# Altium project UW_IPMC_ZYNQ.PrjPcb (part 2 of 2)

## Sheet ZynqPeripherals.SchDoc: ZYNQ-IPMC
size A3; Author: Vicente, M., Gorski., T., Tikalsky, J.; CompanyName: Univ. Wisconsin-Madison; Organization: Univ. Wisconsin-Madison; Address1: Madison, WI 53706; DocumentNumber: 9; Revision: revB; SheetNumber: 9; SheetTotal: 11; ProjectName: ZYNQ-IPMC
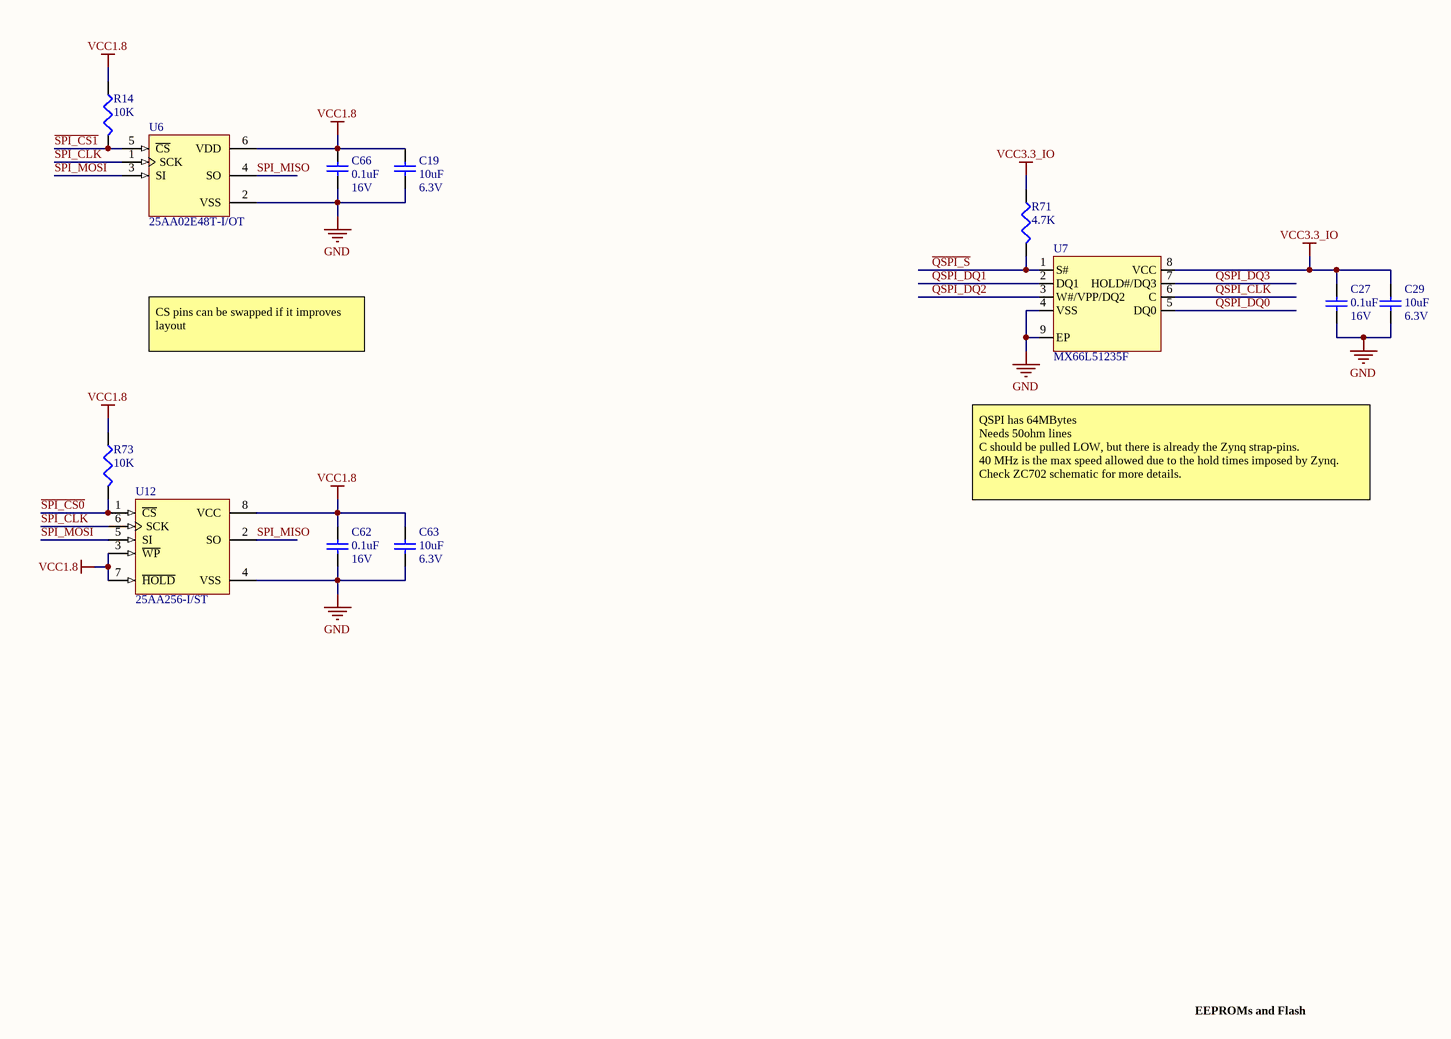
[diagram p7: ZynqPeripherals.SchDoc]

### Parts
C19  value 10uF  Rating: 6.3V  [C0402_IPC_H]  (hidden comment: ?)
C27  value 0.1uF  Rating: 16V  [C0402_IPC_H]  (hidden comment: ?)
C29  value 10uF  Rating: 6.3V  [C0402_IPC_H]  (hidden comment: ?)
C62  value 0.1uF  Rating: 16V  [C0402_IPC_H]  (hidden comment: ?)
C63  value 10uF  Rating: 6.3V  [C0402_IPC_H]  (hidden comment: ?)
C66  value 0.1uF  Rating: 16V  [C0402_IPC_H]  (hidden comment: ?)
R14  value 10K  [R0201_IPC_H]  (hidden comment: ?)
R71  value 4.7K  [R0402_IPC_H]  (hidden comment: ?)
R73  value 10K  [R0201_IPC_H]  (hidden comment: ?)
U6  25AA02E48T-I/OT  [SOT-23-OT6_L]
U7  MX66L51235F  [SON127P800X80_HS-9_N]
U12  25AA256-I/ST  [TSSOP-ST8_L]

### Nets
GND: C19.2 C27.2 C29.2 C62.2 C63.2 C66.2 U6.2(VSS) U7.4(VSS) U7.9(EP) U12.4(VSS)
VCC1.8: C19.1 C62.1 C63.1 C66.1 R14.1 R73.1 U6.6(VDD) U12.3(~{WP}) U12.7(~{HOLD}) U12.8(VCC)
VCC3.3_IO: C27.1 C29.1 R71.1 U7.8(VCC)
~{QSPI_S}: R71.2 U7.1(S#)
~{SPI_CS0}: R73.2 U12.1(~{CS})
~{SPI_CS1}: R14.2 U6.5(~{CS})
QSPI_CLK: U7.6(C)
QSPI_DQ0: U7.5(DQ0)
QSPI_DQ1: U7.2(DQ1)
QSPI_DQ2: U7.3(W#/VPP/DQ2)
QSPI_DQ3: U7.7(HOLD#/DQ3)
SPI_CLK: U6.1(SCK) U12.6(SCK)
SPI_MISO: U6.4(SO) U12.2(SO)
SPI_MOSI: U6.3(SI) U12.5(SI)

### Notes on the sheet
- CS pins can be swapped if it improves layout
- QSPI has 64MBytes
  Needs 50ohm lines
  C should be pulled LOW, but there is already the Zynq strap-pins.
  40 MHz is the max speed allowed due to the hold times imposed by Zynq.
  Check ZC702 schematic for more details.
- EEPROMs and Flash
- Description
- Title
- Size:
- Date:
- A3
- Number:
- Time:
- Revision:
- Sheet
- of
- File:
- Author:

### Library data of the parts
C19 C29 C63 = Cap: as C109 on sheet ZynqPower; PackageDescription: Chip Capacitor
C27 C62 C66 = Cap: as C15 on sheet ZynqMIO; PackageDescription: Chip Capacitor
R14 R73 = Res: as R29 on sheet ZynqMIO; PackageDescription: Chip Resistor
R71 = Res: as R62 on sheet ZynqMIO; PackageDescription: Chip Resistor
U6 = CMP-0165-00270-1: 2K SPI Bus Serial EEPROM with EUI-48 Node Identity, 6-Pin SOT-23, Industrial Temperature, Tape and Reel; Manufacturer: Microchip; INVKEY: IC-EEPROM-2K-SSPI-SOT23; DatasheetVersion: revA, Dec-2008; PackageReference: SOT-23-OT6; PackageVersion: revBB, Aug-2009; PackageDescription: 6-Lead Plastic Small Outline Transistor (OT) [SOT-23]; Code_IPC: SOT26A-6; Part: 25AA02E48T-I/OT
U7 = MX66L51235F: 3V, 512M-bit [x1/x2/x4], CMOS MXSMIO (serial multi I/O) Flash Memory; Part: MX66L51235FZ2I-10G; Manufacturer: Macronix; INVKEY: ?
U12 = CMP-0165-00405-1: 256K SPI Bus Serial EEPROM, 8-Pin TSSOP, Industrial Temperature; Manufacturer: Microchip; INVKEY: IC-EEPROM-256K; Code_JEDEC: MO-153; DatasheetVersion: revF, May-2007; PackageDescription: 8-Lead Plastic Thin Shrink Small Outline (ST) - 4.4mm Body [TSSOP]; PackageReference: TSSOP-ST8; PackageVersion: revBB, Aug-2009; Part: 25AA256-I/ST

## Sheet AnalogSense.SchDoc: ZYNQ-IPMC
size A3; Author: Vicente, M., Gorski., T., Tikalsky, J.; CompanyName: Univ. Wisconsin-Madison; Organization: Univ. Wisconsin-Madison; Address1: Madison, WI 53706; DocumentNumber: 11; Revision: revB; SheetNumber: 11; SheetTotal: 11; ProjectName: ZYNQ-IPMC
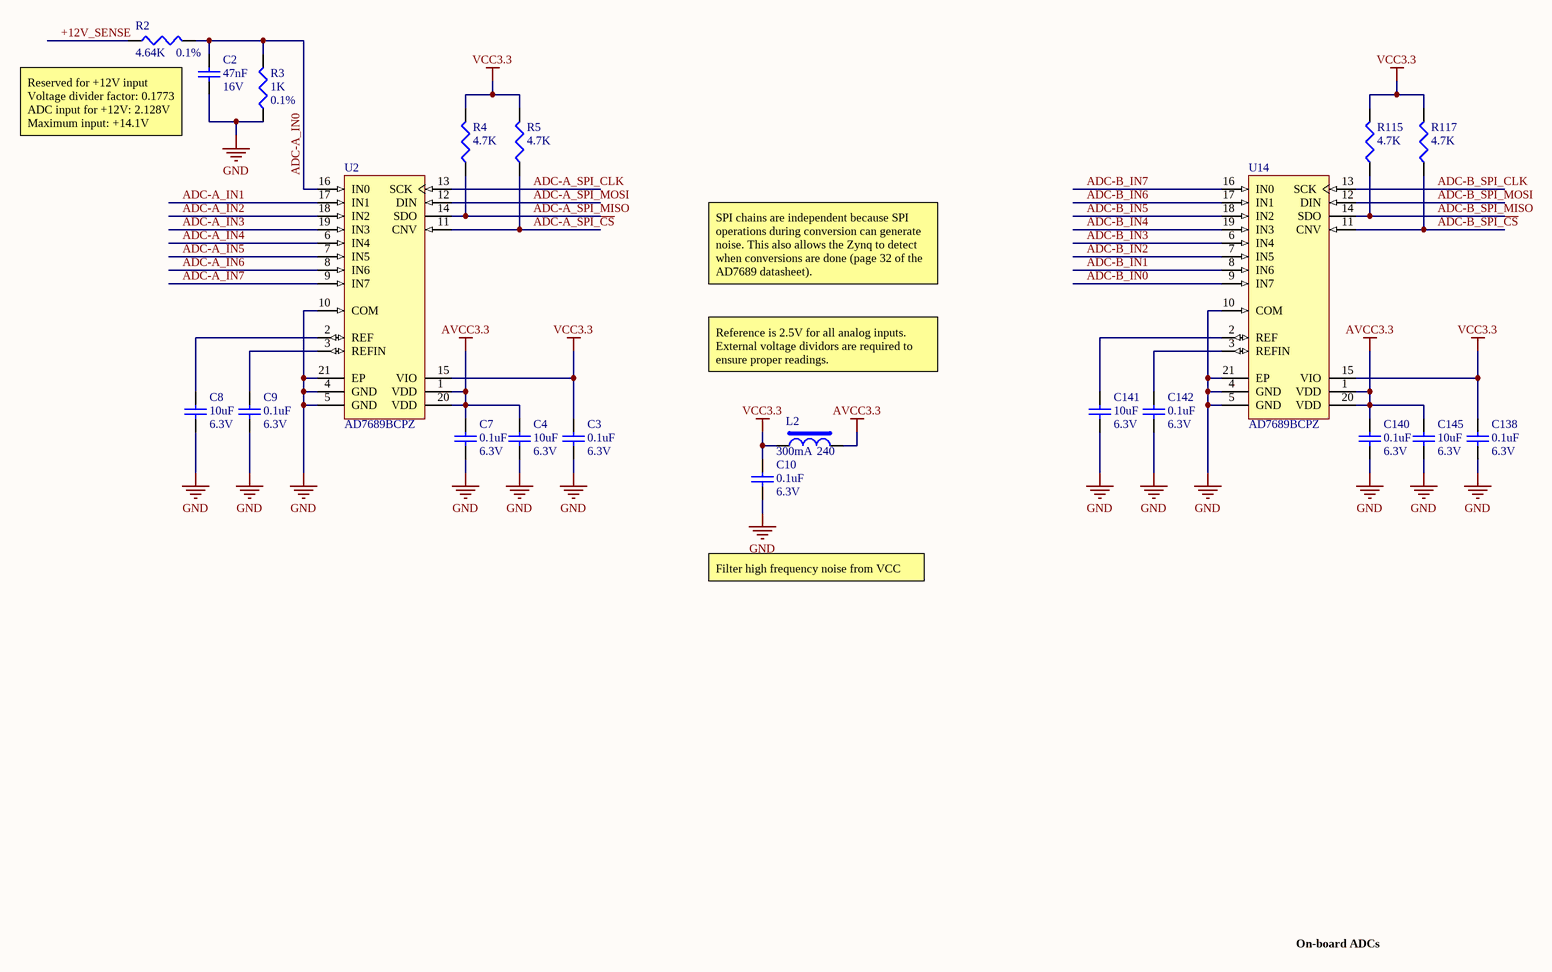
[diagram p8: AnalogSense.SchDoc]

### Parts
C2  value 47nF  Rating: 16V  [C0402_IPC_H]  (hidden comment: ?)
C3  value 0.1uF  Rating: 6.3V  [C0201_IPC_H]  (hidden comment: ?)
C4  value 10uF  Rating: 6.3V  [C0402_IPC_H]  (hidden comment: ?)
C7  value 0.1uF  Rating: 6.3V  [C0201_IPC_H]  (hidden comment: ?)
C8  value 10uF  Rating: 6.3V  [C0402_IPC_H]  (hidden comment: ?)
C9  value 0.1uF  Rating: 6.3V  [C0201_IPC_H]  (hidden comment: ?)
C10  value 0.1uF  Rating: 6.3V  [C0201_IPC_H]  (hidden comment: ?)
C138  value 0.1uF  Rating: 6.3V  [C0201_IPC_H]  (hidden comment: ?)
C140  value 0.1uF  Rating: 6.3V  [C0201_IPC_H]  (hidden comment: ?)
C141  value 10uF  Rating: 6.3V  [C0402_IPC_H]  (hidden comment: ?)
C142  value 0.1uF  Rating: 6.3V  [C0201_IPC_H]  (hidden comment: ?)
C145  value 10uF  Rating: 6.3V  [C0402_IPC_H]  (hidden comment: ?)
L2  value 240  Rated Current: 300mA  [L0402_H]  (hidden comment: BK1005HM241-T)
R2  value 4.64K  Tolerance: 0.1%  [R0603]  (hidden comment: ?)
R3  value 1K  Tolerance: 0.1%  [R0402_IPC_H]  (hidden comment: ?)
R4  value 4.7K  [R0402_IPC_H]  (hidden comment: ?)
R5  value 4.7K  [R0402_IPC_H]  (hidden comment: ?)
R115  value 4.7K  [R0402_IPC_H]  (hidden comment: ?)
R117  value 4.7K  [R0402_IPC_H]  (hidden comment: ?)
U2  AD7689BCPZ  [CP-20-4_N]
U14  AD7689BCPZ  [CP-20-4_N]

### Nets
AVCC3.3: C4.2 C7.2 C140.2 C145.2 L2.2 U2.1(VDD) U2.20(VDD) U14.1(VDD) U14.20(VDD)
GND: C2.1 C3.1 C4.1 C7.1 C8.1 C9.1 C10.1 C138.1 C140.1 C141.1 C142.1 C145.1 R3.1 U2.4(GND) U2.5(GND) U2.10(COM) U2.21(EP) U14.4(GND) U14.5(GND) U14.10(COM) U14.21(EP)
VCC3.3: C3.2 C10.2 C138.2 L2.1 R4.2 R5.2 R115.2 R117.2 U2.15(VIO) U14.15(VIO)
+12V_SENSE: R2.1
~{ADC-A_SPI_CS}: R5.1 U2.11(CNV)
~{ADC-B_SPI_CS}: R117.1 U14.11(CNV)
ADC-A_IN0: C2.2 R2.2 R3.2 U2.16(IN0)
ADC-A_IN1: U2.17(IN1)
ADC-A_IN2: U2.18(IN2)
ADC-A_IN3: U2.19(IN3)
ADC-A_IN4: U2.6(IN4)
ADC-A_IN5: U2.7(IN5)
ADC-A_IN6: U2.8(IN6)
ADC-A_IN7: U2.9(IN7)
ADC-A_SPI_CLK: U2.13(SCK)
ADC-A_SPI_MISO: R4.1 U2.14(SDO)
ADC-A_SPI_MOSI: U2.12(DIN)
ADC-B_IN0: U14.9(IN7)
ADC-B_IN1: U14.8(IN6)
ADC-B_IN2: U14.7(IN5)
ADC-B_IN3: U14.6(IN4)
ADC-B_IN4: U14.19(IN3)
ADC-B_IN5: U14.18(IN2)
ADC-B_IN6: U14.17(IN1)
ADC-B_IN7: U14.16(IN0)
ADC-B_SPI_CLK: U14.13(SCK)
ADC-B_SPI_MISO: R115.1 U14.14(SDO)
ADC-B_SPI_MOSI: U14.12(DIN)
NetC8_2: C8.2 U2.2(REF)
NetC9_2: C9.2 U2.3(REFIN)
NetC141_2: C141.2 U14.2(REF)
NetC142_2: C142.2 U14.3(REFIN)

### Notes on the sheet
- Reserved for +12V input
  Voltage divider factor: 0.1773
  ADC input for +12V: 2.128V
  Maximum input: +14.1V
- SPI chains are independent because SPI operations during conversion can generate noise. This also allows the Zynq to detect when conversions are done (page 32 of the AD7689 datasheet).
- Reference is 2.5V for all analog inputs. External voltage dividors are required to ensure proper readings.
- Filter high frequency noise from VCC
- On-board ADCs
- Description
- Title
- Size:
- Date:
- A3
- Number:
- Time:
- Revision:
- Sheet
- of
- File:
- Author:

### Library data of the parts
C2 = Cap: Capacitor; Part: GRM155R71C473KA01D; Manufacturer: Murata; INVKEY: CP0402-47nf-16V-10%; PackageDescription: Chip Capacitor
C3 C7 C9 C10 C138 C140 C142 = Cap: Capacitor; Manufacturer: Murata; Part: GRM033R60J104KE19D; INVKEY: CP0201-0.1UF-6.3V-10%; PackageDescription: Chip Capacitor
C4 C8 C141 C145 = Cap: Capacitor; Manufacturer: Murata; Part: GRM155R60J106ME44D; INVKEY: CP0402-10UF-6V3-20%; PackageDescription: Chip Capacitor
L2 = Bead: Bead Inductor; Manufacturer: Taiyo Yuden; Measuring Frequency: 100MHz; INVKEY: FB-BK1005HM241-T; PackageDescription: Chip Inductor; Part: BK1005HM241-T
R2 = Res: Resistor; Manufacturer: Susumu Co Ltd; Part: RG1608P-4641-B-T1; INVKEY: RS0603-4K64-1/10W-PREC; PackageDescription: Chip Resistor
R3 = Res: Resistor; Manufacturer: Vishay; Part: TNPW04021K00BEED; INVKEY: RS0402-1K-1/16W-PREC; PackageDescription: Chip Resistor
R4 R5 R115 R117 = Res: Resistor; Manufacturer: Panasonic; Part: ERJ-2RKF4701X; Tolerance: 1%; INVKEY: RS0402-4K7-1/10W-1%; PackageDescription: Chip Resistor
U2 U14 = CMP-0313-00576-2: Octal 16-Bit PulSAR Analog-to-Digital Converter with Serial, SPI Interface, 250KSPS, -40 to +85 degC, CP-20-4, Pb-Free, Tube; Generic Part Number: AD7689; Manufacturer: Analog; Throughput Rate (SPS): 250K; Resolution (Bits): 16; Interface: Ser, SPI; Channels: 8; INVKEY: IC-ADC-AD7689BCPZ; PackageReference: CP-20-4; ComponentLink1Description: Manufacturer URL; Packing: Tube; ComponentLink3Description: Package Specification; RoHS: Y; ComponentLink4Description: Product URL; ComponentLink3URL: http://www.analog.com/static/imported-files/packages/PKG_PDF/LFCSP(CP)/CP_20_4.pdf; ComponentLink1URL: http://www.analog.com/en/index.html; ComponentLink4URL: http://www.analog.com/en/analog-to-digital-converters/ad-converters/ad7689/products/product.html; PackageVersion: 012508-B; ComponentLink2Description: Datasheet; ComponentLink2URL: http://www.analog.com/static/imported-files/data_sheets/AD7682_7689.pdf; PackageDescription: 20-Lead Lead Frame Chip Scale Package [LFCSP_VQ] 4 x 4 mm Body, Very Thin Quad; Mounting Technology: Surface Mount; Code_JEDEC: MO-220-VGGD-1; DatasheetVersion: Rev.D; PartNumber: AD7689BCPZ; Part: AD7689BCPZ

## Sheet PowerSequence.SchDoc: ZYNQ-IPMC
size A3; Author: Vicente, M., Gorski., T., Tikalsky, J.; CompanyName: Univ. Wisconsin-Madison; Organization: Univ. Wisconsin-Madison; Address1: Madison, WI 53706; DocumentNumber: 7; Revision: revB; SheetNumber: 7; SheetTotal: 11; ProjectName: ZYNQ-IPMC
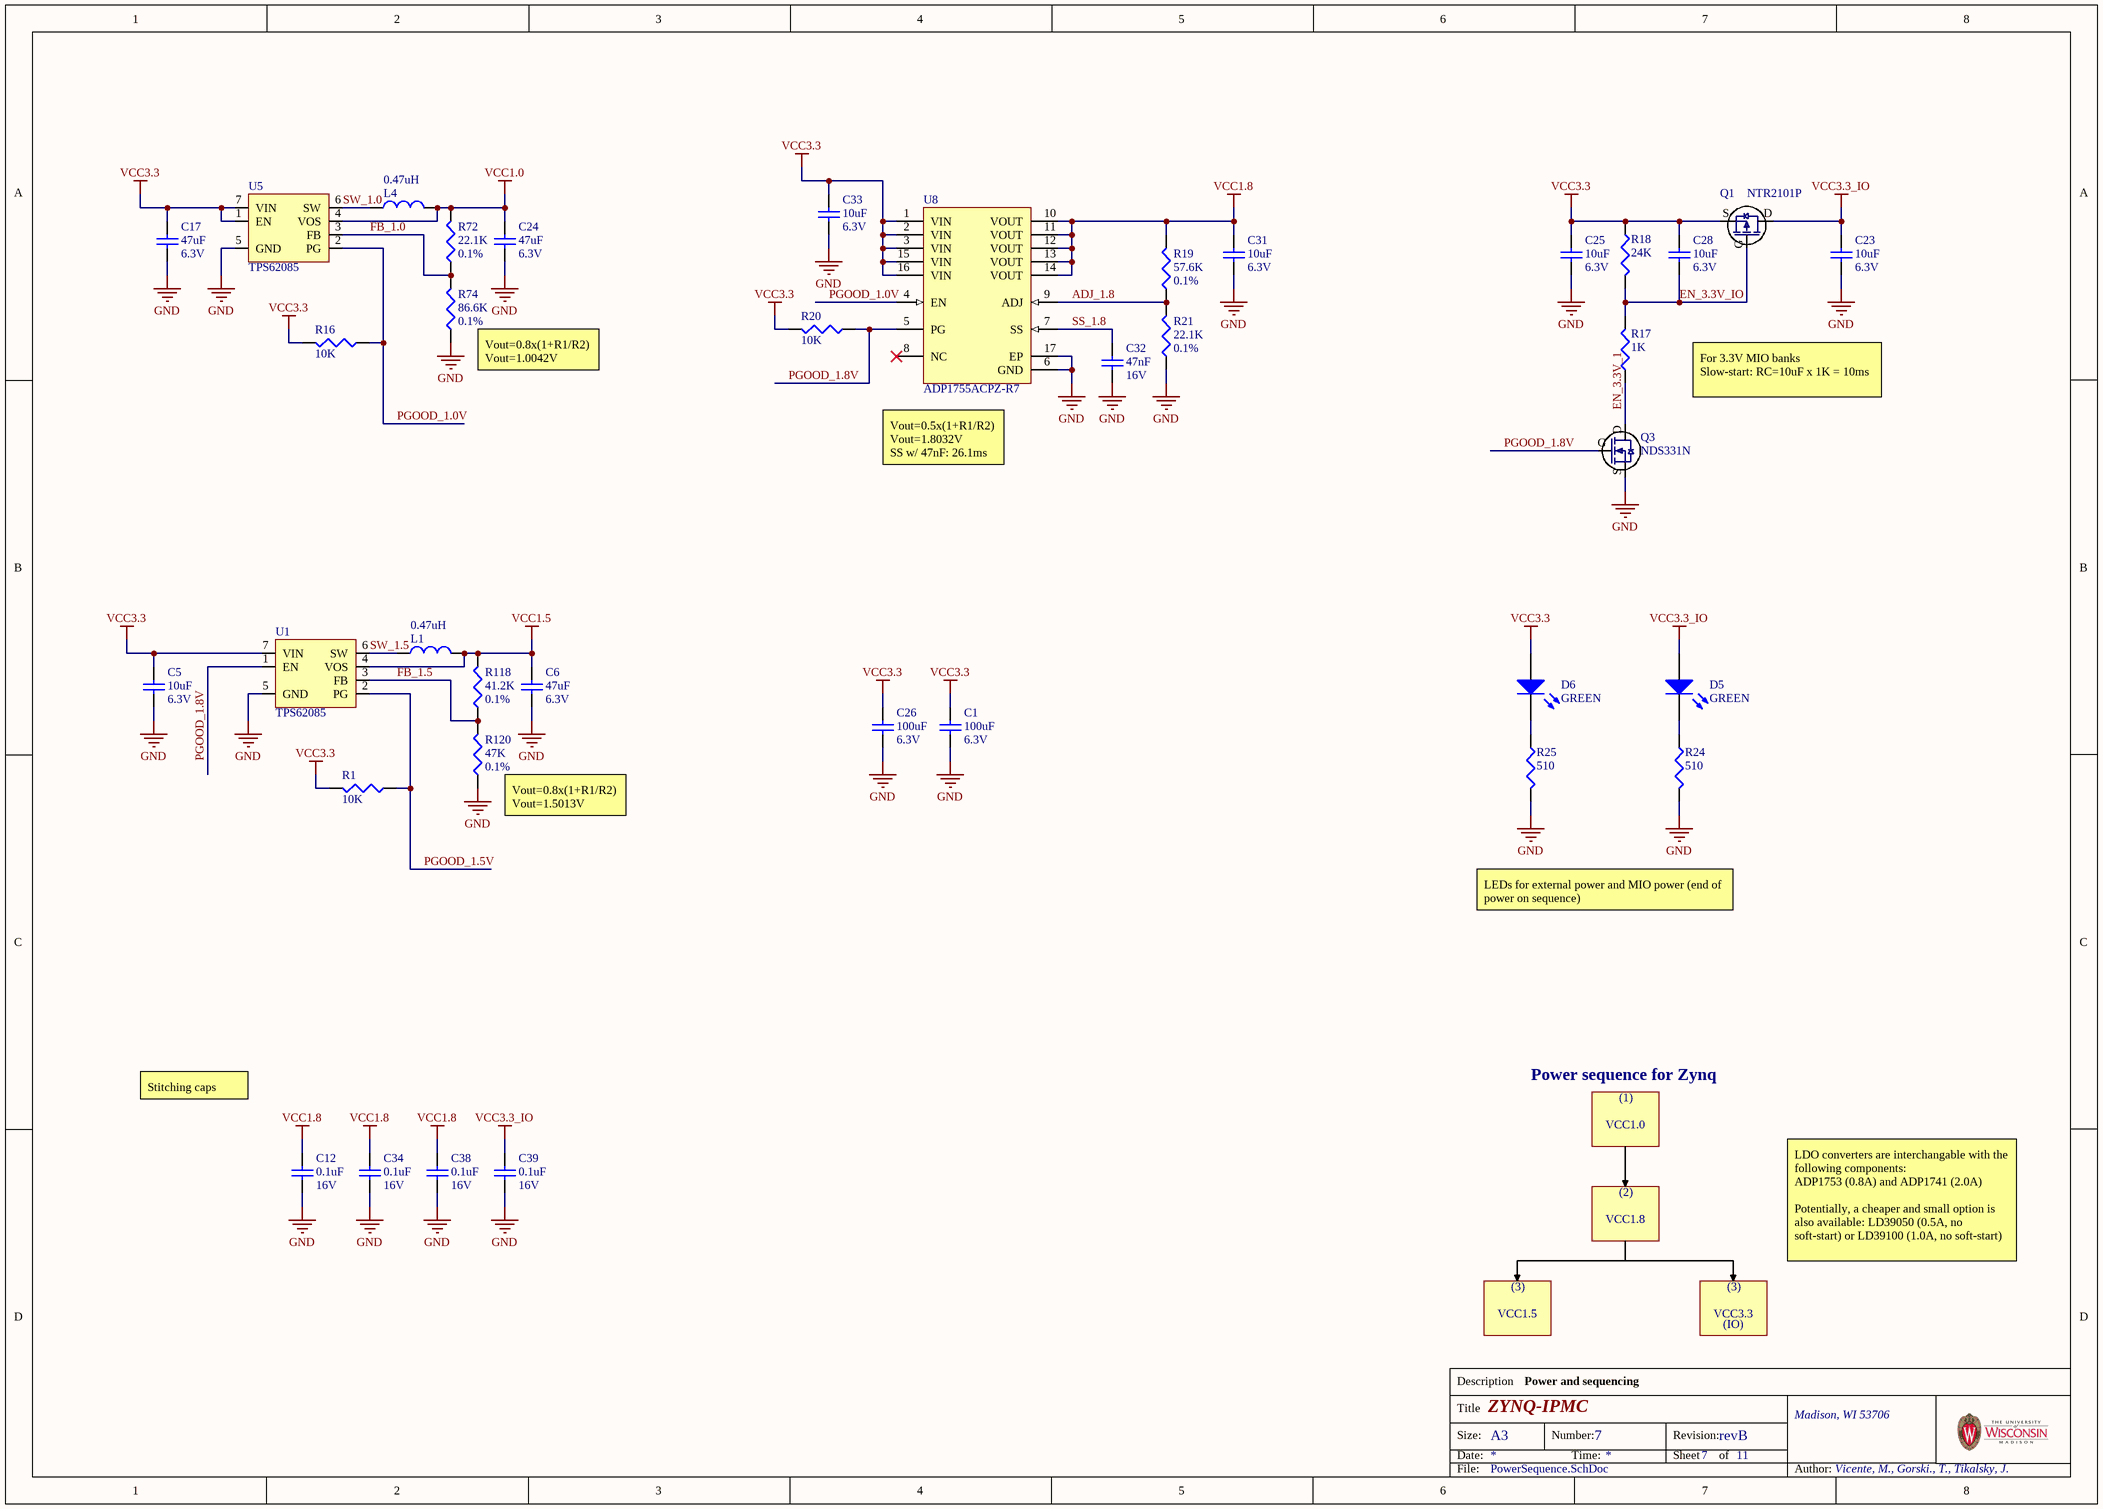
[diagram p9: PowerSequence.SchDoc]

### Parts
C1  value 100uF  Rating: 6.3V  [C1210_IPC_H]  (hidden comment: ?)
C5  value 10uF  Rating: 6.3V  [C0402_IPC_H]  (hidden comment: ?)
C6  value 47uF  Rating: 6.3V  [C0805_M]  (hidden comment: ?)
C12  value 0.1uF  Rating: 16V  [C0402_IPC_H]  (hidden comment: ?)
C17  value 47uF  Rating: 6.3V  [C0805_M]  (hidden comment: ?)
C23  value 10uF  Rating: 6.3V  [C0402_IPC_H]  (hidden comment: ?)
C24  value 47uF  Rating: 6.3V  [C0805_M]  (hidden comment: ?)
C25  value 10uF  Rating: 6.3V  [C0402_IPC_H]  (hidden comment: ?)
C26  value 100uF  Rating: 6.3V  [C1210_IPC_H]  (hidden comment: ?)
C28  value 10uF  Rating: 6.3V  [C0402_IPC_H]  (hidden comment: ?)
C31  value 10uF  Rating: 6.3V  [C0402_IPC_H]  (hidden comment: ?)
C32  value 47nF  Rating: 16V  [C0402_IPC_H]  (hidden comment: ?)
C33  value 10uF  Rating: 6.3V  [C0402_IPC_H]  (hidden comment: ?)
C34  value 0.1uF  Rating: 16V  [C0402_IPC_H]  (hidden comment: ?)
C38  value 0.1uF  Rating: 16V  [C0402_IPC_H]  (hidden comment: ?)
C39  value 0.1uF  Rating: 16V  [C0402_IPC_H]  (hidden comment: ?)
D5  value GREEN  [LED0603_M]  (hidden comment: ?)
D6  value GREEN  [LED0603_M]  (hidden comment: ?)
L1  value 0.47uH  [L2520_H]  (hidden comment: DFE252012F-R47M=P2)
L4  value 0.47uH  [L2520_H]  (hidden comment: DFE252012F-R47M=P2)
Q1  NTR2101P  [SOT23-H]
Q3  NDS331N  [SOT23-H]
R1  value 10K  [R0201_IPC_H]  (hidden comment: ?)
R16  value 10K  [R0201_IPC_H]  (hidden comment: ?)
R17  value 1K  [R0402_IPC_H]  (hidden comment: ?)
R18  value 24K  [R0402_IPC_H]  (hidden comment: ?)
R19  value 57.6K  Tolerance: 0.1%  [R0402_IPC_H]  (hidden comment: ?)
R20  value 10K  [R0201_IPC_H]  (hidden comment: ?)
R21  value 22.1K  Tolerance: 0.1%  [R0402_IPC_H]  (hidden comment: ?)
R24  value 510  [R0402_IPC_H]  (hidden comment: ?)
R25  value 510  [R0402_IPC_H]  (hidden comment: ?)
R72  value 22.1K  Tolerance: 0.1%  [R0402_IPC_H]  (hidden comment: ?)
R74  value 86.6K  Tolerance: 0.1%  [R0402_IPC_H]  (hidden comment: ?)
R118  value 41.2K  Tolerance: 0.1%  [R0402_IPC_H]  (hidden comment: ?)
R120  value 47K  Tolerance: 0.1%  [R0402_IPC_H]  (hidden comment: ?)
U1  TPS62085  [VSON-8_L]
U5  TPS62085  [VSON-8_L]
U8  ADP1755ACPZ-R7  [CP-16-4_L]

### Nets
GND: C1.2 C5.2 C6.1 C12.2 C17.2 C23.2 C24.1 C25.2 C26.2 C31.1 C32.2 C33.2 C34.2 C38.2 C39.2 Q3.S R21.1 R24.2 R25.2 R74.1 R120.1 U1.5(GND) U5.5(GND) U8.6(GND) U8.17(EP)
VCC1.0: C24.2 L4.2 R72.2 U5.4(VOS)
VCC1.5: C6.2 L1.2 R118.2 U1.4(VOS)
VCC1.8: C12.1 C31.2 C34.1 C38.1 R19.2 U8.10(VOUT) U8.11(VOUT) U8.12(VOUT) U8.13(VOUT) U8.14(VOUT)
VCC3.3: C1.1 C5.1 C17.1 C25.1 C26.1 C28.1 C33.1 D6.1(A) Q1.S R1.2 R16.2 R18.1 R20.2 U1.7(VIN) U5.1(EN) U5.7(VIN) U8.1(VIN) U8.2(VIN) U8.3(VIN) U8.15(VIN) U8.16(VIN)
VCC3.3_IO: C23.1 C39.1 D5.1(A) Q1.D
ADJ_1.8: R19.1 R21.2 U8.9(ADJ)
EN_3.3V_1: Q3.D R17.1
EN_3.3V_IO: C28.2 Q1.G R17.2 R18.2
FB_1.0: R72.1 R74.2 U5.3(FB)
FB_1.5: R118.1 R120.2 U1.3(FB)
PGOOD_1.0V: R16.1 U5.2(PG) U8.4(EN)
PGOOD_1.5V: R1.1 U1.2(PG)
PGOOD_1.8V: Q3.G R20.1 U1.1(EN) U8.5(PG)
SS_1.8: C32.1 U8.7(SS)
SW_1.0: L4.1 U5.6(SW)
SW_1.5: L1.1 U1.6(SW)
NetD5_2: D5.2(K) R24.1
NetD6_2: D6.2(K) R25.1

Not connected (* = marked no-connect by the designer): U8 8(NC)*

### Notes on the sheet
- (near R74) Vout=0.8x(1+R1/R2)
  Vout=1.0042V
- For 3.3V MIO banks
  Slow-start: RC=10uF x 1K = 10ms
- (near U8) Vout=0.5x(1+R1/R2)
  Vout=1.8032V
  SS w/ 47nF: 26.1ms
- (near R120) Vout=0.8x(1+R1/R2)
  Vout=1.5013V
- LEDs for external power and MIO power (end of power on sequence)
- Stitching caps
- Power sequence for Zynq
- VCC1.0
- (1)
- VCC1.8
- (2)
- LDO converters are interchangable with the following components:
  ADP1753 (0.8A) and ADP1741 (2.0A)
  Potentially, a cheaper and small option is also available: LD39050 (0.5A, no soft-start) or LD39100 (1.0A, no soft-start)
- VCC1.5
- (3)
- VCC3.3
- (IO)
- Power and sequencing
- Description
- Title
- Size:
- Date:
- A3
- Number:
- Time:
- Revision:
- Sheet
- of
- File:
- Author:

### Library data of the parts
C1 C26 = Cap: Capacitor; Part: GRM32ER60J107ME20L; Manufacturer: Murata; INVKEY: CP1210-100UF-6.3V-20%; PackageDescription: Chip Capacitor
C5 C23 C25 C28 C31 C33 = Cap: as C4 on sheet AnalogSense; PackageDescription: Chip Capacitor
C6 C17 C24 = Cap: Capacitor; Manufacturer: TDK; Part: C2012X5R0J476M125AC; INVKEY: CP0805-47UF-6.3V; PackageDescription: Chip Capacitor
C12 C34 C38 C39 = Cap: Capacitor; Manufacturer: Murata; Part: GRM155R71C104KA88D; INVKEY: CP0402-0.1UF-16V-10%; PackageDescription: Chip Capacitor
C32 = Cap: as C2 on sheet AnalogSense; PackageDescription: Chip Capacitor
D5 D6 = LED: Light Emitting Diode; Manufacturer: Lite-On; Part: LTST-C190KGKT; INVKEY: LED-GN-TOP-0603
L1 L4 = Ind: Inductor; Manufacturer: Murata; Tolerance: 20%; DC Resistance: 23mOhm; DC Current: 6.7A; INVKEY: IND-DFE2520102F; PackageDescription: Chip Inductor; Part: DFE252012F-R47M=P2
Q1 = NTR2101P: Small Signal MOSFET, −8.0V, −3.7 A, Single P−Channel, SOT−23; pin to pad: D>3 G>1 S>2; Manufacturer: On Semiconductor; INVKEY: MOS-NTR2101P-SOT23; Part: NTR2101P
Q3 = NDS331N: N-Channel   Logic Level Enhancement Mode Field Effect Transistor; pin to pad: D>3 G>1 S>2; Manufacturer: Fairchild; INVKEY: FET-NDS331N-SSOT23; Part: NDS331N
R1 R16 R20 = Res: Resistor; Manufacturer: Panasonic; Part: ERJ-1GNF1002C; Tolerance: 1%; INVKEY: RS0201-10K-1/20W-1%; PackageDescription: Chip Resistor
R17 = Res: Resistor; Manufacturer: Panasonic-ECG; Part: ERJ-2RKF1001X; Tolerance: 1%; INVKEY: RS0402-1K-1/10W-1%; PackageDescription: Chip Resistor
R18 = Res: Resistor; Manufacturer: Panasonic; Part: ERJ-2RKF2402X; Tolerance: 1%; INVKEY: RS0402-24K-1/10W-1%; PackageDescription: Chip Resistor
R19 = Res: Resistor; Manufacturer: Panasonic; Part: ERA-2AEB5762X; INVKEY: R0402-57K6-1/16W-PREC; PackageDescription: Chip Resistor
R21 R72 = Res: Resistor; Manufacturer: Panasonic; Part: ERA-2AEB2212X; INVKEY: RS0402-22K1-1/16W-PREC; PackageDescription: Chip Resistor
R24 R25 = Res: Resistor; Manufacturer: Panasonic-ECG; Part: ERJ-2RKF5100X; Tolerance: 1%; INVKEY: RS0402-510R-1/10W-1%; PackageDescription: Chip Resistor
R74 = Res: Resistor; Manufacturer: Panasonic-ECG; Part: ERA-2AEB8662X; INVKEY: RS0402-86K6-1/16W-PREC; PackageDescription: Chip Resistor
R118 = Res: Resistor; Manufacturer: Panasonic; Part: ERA-2AEB4122X; INVKEY: RS0402-41K2-1/16W-PREC; PackageDescription: Chip Resistor
R120 = Res: Resistor; Manufacturer: Panasonic; Part: ERA-2AEB473X; INVKEY: RS0402-47K-1/16W-PREC; PackageDescription: Chip Resistor
U1 U5 = TPS62085: 3-A Step-Down Converter With Hiccup Short-Circuit Protection; Manufacturer: Texas Instruments; INVKEY: IC-TPS62085; Part: TPS62085
U8 = CMP-0786-00436-1: 1.2 A, Low VIN, Low Dropout Linear Regulator, 1.6 to 3.6 V Vin, 0.75 to 3 V Vout, Industrial, 16-pin QFN (CP-16-4), Reel; Manufacturer: Analog; Vin (min) (V): 1.6; Vin (max) (V): 3.6; Vout Adjustable Range: 0.75V to 3.3V; Iout max: 1.2A; Supply Current IGND @ Small Load: 90uA; INVKEY: IC-REG-ADP1755ACPZ; PackageVersion: 010606-0, 01/2006; ComponentLink3URL: http://www.analog.com/static/imported-files/packages/46009454504174339653421710019CP_16_4.pdf; ComponentLink4URL: Product URL:http://www.analog.com/en/ADP1755/productSearch.html; ComponentLink1Description: Manufacturer URL; Packing: Reel; PackageDescription: 16-Pin Lead Frame Chip Scale Package, Body 4 x 4 mm, Pitch 0.65 mm; ComponentLink2URL: http://www.analog.com/static/imported-files/data_sheets/ADP1754_1755.pdf; PackageReference: CP-16-4; DatasheetVersion: Rev. D; ComponentLink4Description: URL Link1; Code_JEDEC: MO-220-VGGC; PartNumber: ADP1755ACPZ-R7; ComponentLink3Description: Package Specification; Mounting Technology: Surface Mount; ComponentLink1URL: http://www.analog.com/en/index.html; ComponentLink2Description: Datasheet; Part: ADP1755ACPZ-R7

## Sheet BoardConnector.SchDoc: ZYNQ-IPMC
size A3; Author: Vicente, M., Gorski., T., Tikalsky, J.; CompanyName: Univ. Wisconsin-Madison; Organization: Univ. Wisconsin-Madison; Address1: Madison, WI 53706; DocumentNumber: 2; Revision: revB; SheetNumber: 2; SheetTotal: 11; ProjectName: ZYNQ-IPMC
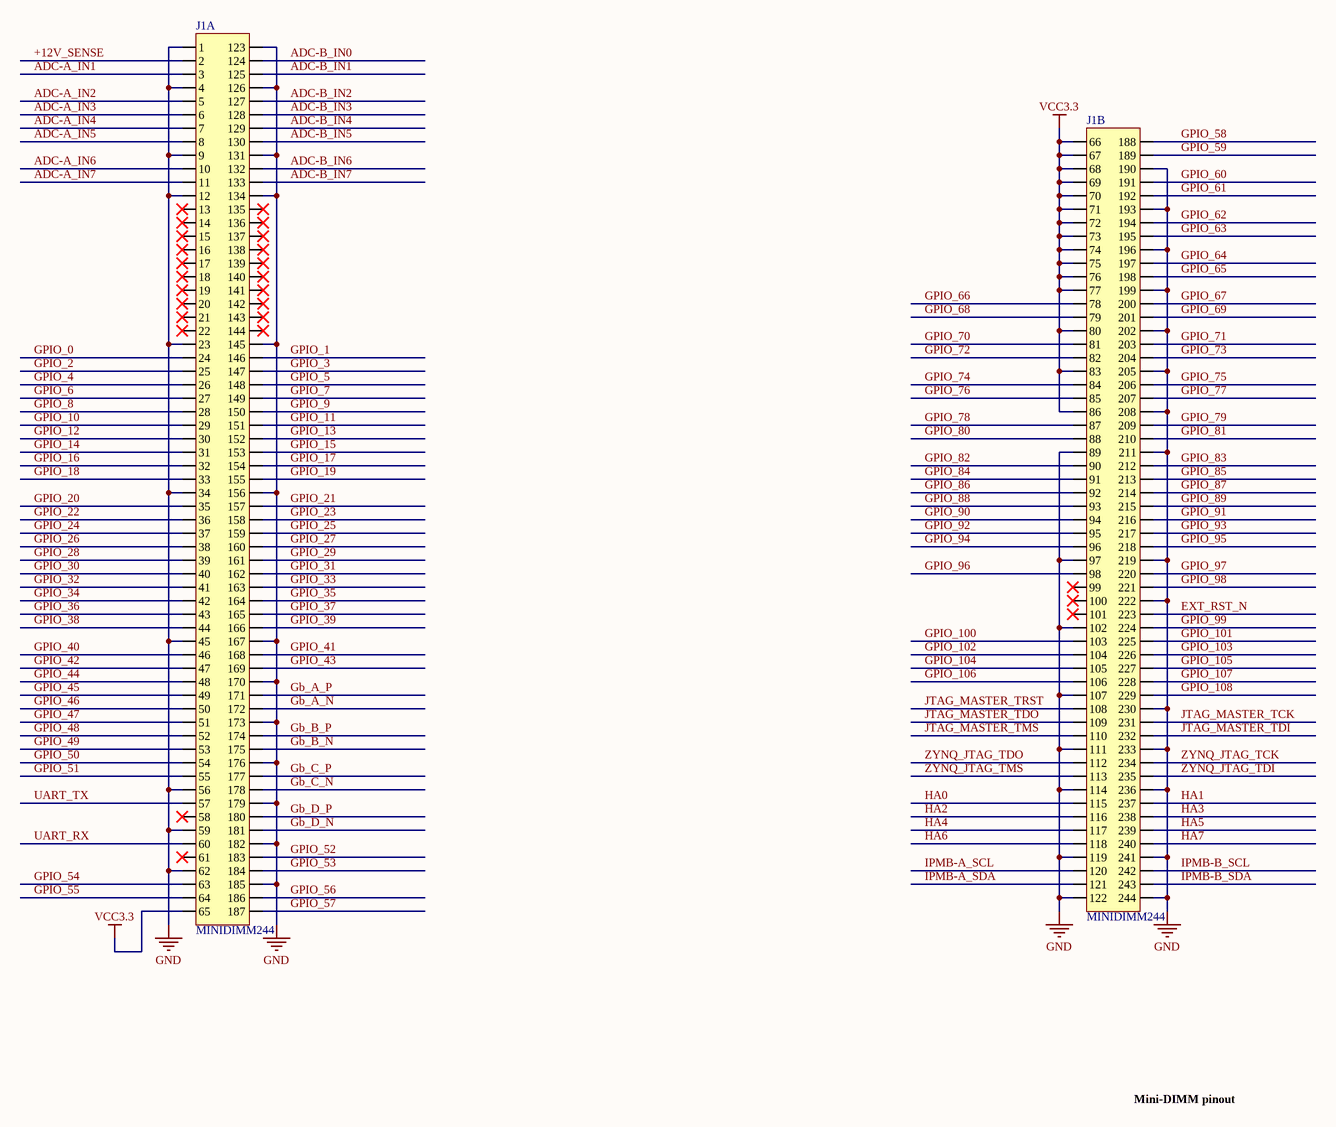
[diagram p10: BoardConnector.SchDoc]

### Parts
J1  MINIDIMM244  [miniDIMM244]  (parts A,B of 2)

### Nets
GND: J1.1 J1.4 J1.9 J1.12 J1.23 J1.34 J1.45 J1.56 J1.59 J1.62 J1.89 J1.97 J1.102 J1.107 J1.111 J1.114 J1.119 J1.122 J1.123 J1.126 J1.131 J1.134 J1.145 J1.156 J1.167 J1.170 J1.173 J1.176 J1.179 J1.182 J1.185 J1.190 J1.193 J1.196 J1.199 J1.202 J1.205 J1.208 J1.211 J1.219 J1.222 J1.230 J1.233 J1.236 J1.241 J1.244
VCC3.3: J1.65 J1.66 J1.67 J1.68 J1.69 J1.70 J1.71 J1.72 J1.73 J1.74 J1.75 J1.76 J1.77 J1.80 J1.83 J1.86
+12V_SENSE: J1.2
ADC-A_IN1: J1.3
ADC-A_IN2: J1.5
ADC-A_IN3: J1.6
ADC-A_IN4: J1.7
ADC-A_IN5: J1.8
ADC-A_IN6: J1.10
ADC-A_IN7: J1.11
ADC-B_IN0: J1.124
ADC-B_IN1: J1.125
ADC-B_IN2: J1.127
ADC-B_IN3: J1.128
ADC-B_IN4: J1.129
ADC-B_IN5: J1.130
ADC-B_IN6: J1.132
ADC-B_IN7: J1.133
EXT_RST_N: J1.223
Gb_A_N: J1.172
Gb_A_P: J1.171
Gb_B_N: J1.175
Gb_B_P: J1.174
Gb_C_N: J1.178
Gb_C_P: J1.177
Gb_D_N: J1.181
Gb_D_P: J1.180
GPIO_0: J1.24
GPIO_1: J1.146
GPIO_2: J1.25
GPIO_3: J1.147
GPIO_4: J1.26
GPIO_5: J1.148
GPIO_6: J1.27
GPIO_7: J1.149
GPIO_8: J1.28
GPIO_9: J1.150
GPIO_10: J1.29
GPIO_11: J1.151
GPIO_12: J1.30
GPIO_13: J1.152
GPIO_14: J1.31
GPIO_15: J1.153
GPIO_16: J1.32
GPIO_17: J1.154
GPIO_18: J1.33
GPIO_19: J1.155
GPIO_20: J1.35
GPIO_21: J1.157
GPIO_22: J1.36
GPIO_23: J1.158
GPIO_24: J1.37
GPIO_25: J1.159
GPIO_26: J1.38
GPIO_27: J1.160
GPIO_28: J1.39
GPIO_29: J1.161
GPIO_30: J1.40
GPIO_31: J1.162
GPIO_32: J1.41
GPIO_33: J1.163
GPIO_34: J1.42
GPIO_35: J1.164
GPIO_36: J1.43
GPIO_37: J1.165
GPIO_38: J1.44
GPIO_39: J1.166
GPIO_40: J1.46
GPIO_41: J1.168
GPIO_42: J1.47
GPIO_43: J1.169
GPIO_44: J1.48
GPIO_45: J1.49
GPIO_46: J1.50
GPIO_47: J1.51
GPIO_48: J1.52
GPIO_49: J1.53
GPIO_50: J1.54
GPIO_51: J1.55
GPIO_52: J1.183
GPIO_53: J1.184
GPIO_54: J1.63
GPIO_55: J1.64
GPIO_56: J1.186
GPIO_57: J1.187
GPIO_58: J1.188
GPIO_59: J1.189
GPIO_60: J1.191
GPIO_61: J1.192
GPIO_62: J1.194
GPIO_63: J1.195
GPIO_64: J1.197
GPIO_65: J1.198
GPIO_66: J1.78
GPIO_67: J1.200
GPIO_68: J1.79
GPIO_69: J1.201
GPIO_70: J1.81
GPIO_71: J1.203
GPIO_72: J1.82
GPIO_73: J1.204
GPIO_74: J1.84
GPIO_75: J1.206
GPIO_76: J1.85
GPIO_77: J1.207
GPIO_78: J1.87
GPIO_79: J1.209
GPIO_80: J1.88
GPIO_81: J1.210
GPIO_82: J1.90
GPIO_83: J1.212
GPIO_84: J1.91
GPIO_85: J1.213
GPIO_86: J1.92
GPIO_87: J1.214
GPIO_88: J1.93
GPIO_89: J1.215
GPIO_90: J1.94
GPIO_91: J1.216
GPIO_92: J1.95
GPIO_93: J1.217
GPIO_94: J1.96
GPIO_95: J1.218
GPIO_96: J1.98
GPIO_97: J1.220
GPIO_98: J1.221
GPIO_99: J1.224
GPIO_100: J1.103
GPIO_101: J1.225
GPIO_102: J1.104
GPIO_103: J1.226
GPIO_104: J1.105
GPIO_105: J1.227
GPIO_106: J1.106
GPIO_107: J1.228
GPIO_108: J1.229
HA0: J1.115
HA1: J1.237
HA2: J1.116
HA3: J1.238
HA4: J1.117
HA5: J1.239
HA6: J1.118
HA7: J1.240
IPMB-A_SCL: J1.120
IPMB-A_SDA: J1.121
IPMB-B_SCL: J1.242
IPMB-B_SDA: J1.243
JTAG_MASTER_TCK: J1.231
JTAG_MASTER_TDI: J1.232
JTAG_MASTER_TDO: J1.109
JTAG_MASTER_TMS: J1.110
JTAG_MASTER_TRST: J1.108
UART_RX: J1.60
UART_TX: J1.57
ZYNQ_JTAG_TCK: J1.234
ZYNQ_JTAG_TDI: J1.235
ZYNQ_JTAG_TDO: J1.112
ZYNQ_JTAG_TMS: J1.113

Not connected (* = marked no-connect by the designer): J1 13* 14* 15* 16* 17* 18* 19* 20* 21* 22* 58* 61* 99* 100* 101* 135* 136* 137* 138* 139* 140* 141* 142* 143* 144*

### Notes on the sheet
- Mini-DIMM pinout
- Description
- Title
- Size:
- Date:
- A3
- Number:
- Time:
- Revision:
- Sheet
- of
- File:
- Author:

### Library data of the parts
J1 = MINIDIMM244: 244-pin miniDIMM pads; Note: NOT A PART

## Nets that join several sheets
GND: ZynqMIO (20 pins), ZynqPower (125 pins), ZynqDDR (57 pins), Ethernet (32 pins), ZynqPeripherals (10 pins), AnalogSense (21 pins), PowerSequence (25 pins), BoardConnector (46 pins)
VCC1.0: ZynqPower (34 pins), PowerSequence (C24.2 L4.2 R72.2 U5.4)
VCC1.5: ZynqPower (16 pins), ZynqDDR (38 pins), PowerSequence (C6.2 L1.2 R118.2 U1.4)
VCC1.8: ZynqMIO (5 pins), ZynqPower (27 pins), Ethernet (C36.2 R22.1 U9.1 U9.5), ZynqPeripherals (10 pins), PowerSequence (10 pins)
VCC3.3: ZynqMIO (11 pins), ZynqEMIO (D1.1 D2.1), ZynqPower (R28.1 R49.1 R53.1), ZynqDDR (C148.2 U15.7 U15.10), Ethernet (9 pins), AnalogSense (10 pins), PowerSequence (21 pins), BoardConnector (16 pins)
VCC3.3_IO: ZynqMIO (5 pins), ZynqEMIO (U4.U13), ZynqPower (49 pins), ZynqPeripherals (C27.1 C29.1 R71.1 U7.8), PowerSequence (C23.1 C39.1 D5.1 Q1.D)
+12V_SENSE: AnalogSense (R2.1), BoardConnector (J1.2)
~{ADC-A_SPI_CS}: ZynqEMIO (U4.V7), AnalogSense (R5.1 U2.11)
~{ADC-B_SPI_CS}: ZynqEMIO (U4.Y6), AnalogSense (R117.1 U14.11)
~{QSPI_S}: ZynqMIO (U4.A7), ZynqPeripherals (R71.2 U7.1)
~{SPI_CS0}: ZynqMIO (U4.C15), ZynqPeripherals (R73.2 U12.1)
~{SPI_CS1}: ZynqMIO (U4.E16), ZynqPeripherals (R14.2 U6.5)
ADC-A_IN1: AnalogSense (U2.17), BoardConnector (J1.3)
ADC-A_IN2: AnalogSense (U2.18), BoardConnector (J1.5)
ADC-A_IN3: AnalogSense (U2.19), BoardConnector (J1.6)
ADC-A_IN4: AnalogSense (U2.6), BoardConnector (J1.7)
ADC-A_IN5: AnalogSense (U2.7), BoardConnector (J1.8)
ADC-A_IN6: AnalogSense (U2.8), BoardConnector (J1.10)
ADC-A_IN7: AnalogSense (U2.9), BoardConnector (J1.11)
ADC-A_SPI_CLK: ZynqEMIO (U4.U7), AnalogSense (U2.13)
ADC-A_SPI_MISO: ZynqEMIO (U4.T9), AnalogSense (R4.1 U2.14)
ADC-A_SPI_MOSI: ZynqEMIO (U4.U10), AnalogSense (U2.12)
ADC-B_IN0: AnalogSense (U14.9), BoardConnector (J1.124)
ADC-B_IN1: AnalogSense (U14.8), BoardConnector (J1.125)
ADC-B_IN2: AnalogSense (U14.7), BoardConnector (J1.127)
ADC-B_IN3: AnalogSense (U14.6), BoardConnector (J1.128)
ADC-B_IN4: AnalogSense (U14.19), BoardConnector (J1.129)
ADC-B_IN5: AnalogSense (U14.18), BoardConnector (J1.130)
ADC-B_IN6: AnalogSense (U14.17), BoardConnector (J1.132)
ADC-B_IN7: AnalogSense (U14.16), BoardConnector (J1.133)
ADC-B_SPI_CLK: ZynqEMIO (U4.Y7), AnalogSense (U14.13)
ADC-B_SPI_MISO: ZynqEMIO (U4.Y9), AnalogSense (R115.1 U14.14)
ADC-B_SPI_MOSI: ZynqEMIO (U4.Y8), AnalogSense (U14.12)
EXT_RST_N: ZynqMIO (Q2.D R62.2), BoardConnector (J1.223)
Gb_A_N: Ethernet (U10.14), BoardConnector (J1.172)
Gb_A_P: Ethernet (U10.13), BoardConnector (J1.171)
Gb_B_N: Ethernet (U10.17), BoardConnector (J1.175)
Gb_B_P: Ethernet (U10.16), BoardConnector (J1.174)
Gb_C_N: Ethernet (U10.20), BoardConnector (J1.178)
Gb_C_P: Ethernet (U10.19), BoardConnector (J1.177)
Gb_D_N: Ethernet (U10.23), BoardConnector (J1.181)
Gb_D_P: Ethernet (U10.22), BoardConnector (J1.180)
GPIO_0: ZynqEMIO (U4.U5), BoardConnector (J1.24)
GPIO_1: ZynqEMIO (U4.P14), BoardConnector (J1.146)
GPIO_2: ZynqEMIO (U4.T5), BoardConnector (J1.25)
GPIO_3: ZynqEMIO (U4.T10), BoardConnector (J1.147)
GPIO_4: ZynqEMIO (U4.U8), BoardConnector (J1.26)
GPIO_5: ZynqEMIO (U4.T11), BoardConnector (J1.148)
GPIO_6: ZynqEMIO (U4.U9), BoardConnector (J1.27)
GPIO_7: ZynqEMIO (U4.T12), BoardConnector (J1.149)
GPIO_8: ZynqEMIO (U4.W8), BoardConnector (J1.28)
GPIO_9: ZynqEMIO (U4.T14), BoardConnector (J1.150)
GPIO_10: ZynqEMIO (U4.W9), BoardConnector (J1.29)
GPIO_11: ZynqEMIO (U4.U12), BoardConnector (J1.151)
GPIO_12: ZynqEMIO (U4.W10), BoardConnector (J1.30)
GPIO_13: ZynqEMIO (U4.T15), BoardConnector (J1.152)
GPIO_14: ZynqEMIO (U4.W11), BoardConnector (J1.31)
GPIO_15: ZynqEMIO (U4.V12), BoardConnector (J1.153)
GPIO_16: ZynqEMIO (U4.Y11), BoardConnector (J1.32)
GPIO_17: ZynqEMIO (U4.W13), BoardConnector (J1.154)
GPIO_18: ZynqEMIO (U4.Y12), BoardConnector (J1.33)
GPIO_19: ZynqEMIO (U4.V13), BoardConnector (J1.155)
GPIO_20: ZynqEMIO (U4.R14), BoardConnector (J1.35)
GPIO_21: ZynqEMIO (U4.W18), BoardConnector (J1.157)
GPIO_22: ZynqEMIO (U4.W15), BoardConnector (J1.36)
GPIO_23: ZynqEMIO (U4.V16), BoardConnector (J1.158)
GPIO_24: ZynqEMIO (U4.T16), BoardConnector (J1.37)
GPIO_25: ZynqEMIO (U4.T17), BoardConnector (J1.159)
GPIO_26: ZynqEMIO (U4.U17), BoardConnector (J1.38)
GPIO_27: ZynqEMIO (U4.Y18), BoardConnector (J1.160)
GPIO_28: ZynqEMIO (U4.Y14), BoardConnector (J1.39)
GPIO_29: ZynqEMIO (U4.W16), BoardConnector (J1.161)
GPIO_30: ZynqEMIO (U4.W14), BoardConnector (J1.40)
GPIO_31: ZynqEMIO (U4.V17), BoardConnector (J1.162)
GPIO_32: ZynqEMIO (U4.U14), BoardConnector (J1.41)
GPIO_33: ZynqEMIO (U4.W19), BoardConnector (J1.163)
GPIO_34: ZynqEMIO (U4.Y16), BoardConnector (J1.42)
GPIO_35: ZynqEMIO (U4.Y19), BoardConnector (J1.164)
GPIO_36: ZynqEMIO (U4.V15), BoardConnector (J1.43)
GPIO_37: ZynqEMIO (U4.V18), BoardConnector (J1.165)
GPIO_38: ZynqEMIO (U4.Y17), BoardConnector (J1.44)
GPIO_39: ZynqEMIO (U4.W20), BoardConnector (J1.166)
GPIO_40: ZynqEMIO (U4.U15), BoardConnector (J1.46)
GPIO_41: ZynqEMIO (U4.W6), BoardConnector (J1.168)
GPIO_42: ZynqEMIO (U4.U18), BoardConnector (J1.47)
GPIO_43: ZynqEMIO (U4.V6), BoardConnector (J1.169)
GPIO_44: ZynqEMIO (U4.P19), BoardConnector (J1.48)
GPIO_45: ZynqEMIO (U4.N18), BoardConnector (J1.49)
GPIO_46: ZynqEMIO (U4.N20), BoardConnector (J1.50)
GPIO_47: ZynqEMIO (U4.U19), BoardConnector (J1.51)
GPIO_48: ZynqEMIO (U4.P20), BoardConnector (J1.52)
GPIO_49: ZynqEMIO (U4.V20), BoardConnector (J1.53)
GPIO_50: ZynqEMIO (U4.U20), BoardConnector (J1.54)
GPIO_51: ZynqEMIO (U4.T20), BoardConnector (J1.55)
GPIO_52: ZynqEMIO (U4.V10), BoardConnector (J1.183)
GPIO_53: ZynqEMIO (U4.V11), BoardConnector (J1.184)
GPIO_54: ZynqEMIO (U4.Y13), BoardConnector (J1.63)
GPIO_55: ZynqEMIO (U4.R16), BoardConnector (J1.64)
GPIO_56: ZynqEMIO (U4.R17), BoardConnector (J1.186)
GPIO_57: ZynqEMIO (U4.R18), BoardConnector (J1.187)
GPIO_58: ZynqEMIO (U4.N17), BoardConnector (J1.188)
GPIO_59: ZynqEMIO (U4.P18), BoardConnector (J1.189)
GPIO_60: ZynqEMIO (U4.P15), BoardConnector (J1.191)
GPIO_61: ZynqEMIO (U4.P16), BoardConnector (J1.192)
GPIO_62: ZynqEMIO (U4.T19), BoardConnector (J1.194)
GPIO_63: ZynqEMIO (U4.R19), BoardConnector (J1.195)
GPIO_64: ZynqEMIO_2 (U4.N15), BoardConnector (J1.197)
GPIO_65: ZynqEMIO_2 (U4.N16), BoardConnector (J1.198)
GPIO_66: ZynqEMIO_2 (U4.M14), BoardConnector (J1.78)
GPIO_67: ZynqEMIO_2 (U4.M15), BoardConnector (J1.200)
GPIO_68: ZynqEMIO_2 (U4.M17), BoardConnector (J1.79)
GPIO_69: ZynqEMIO_2 (U4.M18), BoardConnector (J1.201)
GPIO_70: ZynqEMIO_2 (U4.M19), BoardConnector (J1.81)
GPIO_71: ZynqEMIO_2 (U4.M20), BoardConnector (J1.203)
GPIO_72: ZynqEMIO_2 (U4.L14), BoardConnector (J1.82)
GPIO_73: ZynqEMIO_2 (U4.L15), BoardConnector (J1.204)
GPIO_74: ZynqEMIO_2 (U4.L16), BoardConnector (J1.84)
GPIO_75: ZynqEMIO_2 (U4.L17), BoardConnector (J1.206)
GPIO_76: ZynqEMIO_2 (U4.L20), BoardConnector (J1.85)
GPIO_77: ZynqEMIO_2 (U4.L19), BoardConnector (J1.207)
GPIO_78: ZynqEMIO_2 (U4.K14), BoardConnector (J1.87)
GPIO_79: ZynqEMIO_2 (U4.J14), BoardConnector (J1.209)
GPIO_80: ZynqEMIO_2 (U4.K17), BoardConnector (J1.88)
GPIO_81: ZynqEMIO_2 (U4.K16), BoardConnector (J1.210)
GPIO_82: ZynqEMIO_2 (U4.K18), BoardConnector (J1.90)
GPIO_83: ZynqEMIO_2 (U4.G14), BoardConnector (J1.212)
GPIO_84: ZynqEMIO_2 (U4.J19), BoardConnector (J1.91)
GPIO_85: ZynqEMIO_2 (U4.K19), BoardConnector (J1.213)
GPIO_86: ZynqEMIO_2 (U4.J16), BoardConnector (J1.92)
GPIO_87: ZynqEMIO_2 (U4.J15), BoardConnector (J1.214)
GPIO_88: ZynqEMIO_2 (U4.J20), BoardConnector (J1.93)
GPIO_89: ZynqEMIO_2 (U4.H20), BoardConnector (J1.215)
GPIO_90: ZynqEMIO_2 (U4.J18), BoardConnector (J1.94)
GPIO_91: ZynqEMIO_2 (U4.H18), BoardConnector (J1.216)
GPIO_92: ZynqEMIO_2 (U4.H17), BoardConnector (J1.95)
GPIO_93: ZynqEMIO_2 (U4.H16), BoardConnector (J1.217)
GPIO_94: ZynqEMIO_2 (U4.H15), BoardConnector (J1.96)
GPIO_95: ZynqEMIO_2 (U4.G15), BoardConnector (J1.218)
GPIO_96: ZynqEMIO_2 (U4.G17), BoardConnector (J1.98)
GPIO_97: ZynqEMIO_2 (U4.G18), BoardConnector (J1.220)
GPIO_98: ZynqEMIO_2 (U4.G19), BoardConnector (J1.221)
GPIO_99: ZynqEMIO_2 (U4.G20), BoardConnector (J1.224)
GPIO_100: ZynqEMIO_2 (U4.F16), BoardConnector (J1.103)
GPIO_101: ZynqEMIO_2 (U4.F20), BoardConnector (J1.225)
GPIO_102: ZynqEMIO_2 (U4.F17), BoardConnector (J1.104)
GPIO_103: ZynqEMIO_2 (U4.E18), BoardConnector (J1.226)
GPIO_104: ZynqEMIO_2 (U4.D18), BoardConnector (J1.105)
GPIO_105: ZynqEMIO_2 (U4.E19), BoardConnector (J1.227)
GPIO_106: ZynqEMIO_2 (U4.D19), BoardConnector (J1.106)
GPIO_107: ZynqEMIO_2 (U4.F19), BoardConnector (J1.228)
GPIO_108: ZynqEMIO_2 (U4.D20), BoardConnector (J1.229)
HA0: ZynqMIO (R29.2 R30.2 U4.C18), BoardConnector (J1.115)
HA1: ZynqMIO (R46.2 R47.2 U4.D14), BoardConnector (J1.237)
HA2: ZynqMIO (R31.2 R32.2 U4.C17), BoardConnector (J1.116)
HA3: ZynqMIO (R44.2 R45.2 U4.B15), BoardConnector (J1.238)
HA4: ZynqMIO (R34.2 R35.2 U4.B14), BoardConnector (J1.117)
HA5: ZynqMIO (R42.2 R43.2 U4.B12), BoardConnector (J1.239)
HA6: ZynqMIO (R36.2 R37.2 U4.C12), BoardConnector (J1.118)
HA7: ZynqMIO (R40.2 R41.2 U4.B13), BoardConnector (J1.240)
IPMB-A_SCL: ZynqMIO (U4.E9), BoardConnector (J1.120)
IPMB-A_SDA: ZynqMIO (U4.C6), BoardConnector (J1.121)
IPMB-B_SCL: ZynqMIO (U4.D9), BoardConnector (J1.242)
IPMB-B_SDA: ZynqMIO (U4.E8), BoardConnector (J1.243)
JTAG_MASTER_TCK: ZynqEMIO_2 (R11.1), BoardConnector (J1.231)
JTAG_MASTER_TDI: ZynqEMIO_2 (R12.1), BoardConnector (J1.232)
JTAG_MASTER_TDO: ZynqEMIO_2 (U4.E17), BoardConnector (J1.109)
JTAG_MASTER_TMS: ZynqEMIO_2 (R75.1), BoardConnector (J1.110)
JTAG_MASTER_TRST: ZynqEMIO_2 (R10.1), BoardConnector (J1.108)
MDIO_CLK: ZynqMIO (U4.C10), Ethernet (U9.2)
MDIO_DIO: ZynqMIO (U4.C11), Ethernet (U9.3)
PHY_RESET: ZynqMIO (U4.B5), Ethernet (R23.1 U11.1)
QSPI_CLK: ZynqMIO (R68.2 U4.A5), ZynqPeripherals (U7.6)
QSPI_DQ0: ZynqMIO (R66.2 U4.B8), ZynqPeripherals (U7.5)
QSPI_DQ1: ZynqMIO (R69.2 U4.D6), ZynqPeripherals (U7.2)
QSPI_DQ2: ZynqMIO (R67.2 U4.B7), ZynqPeripherals (U7.3)
QSPI_DQ3: ZynqMIO (R70.2 U4.A6), ZynqPeripherals (U7.7)
RGMII_RX_CLK: ZynqMIO (U4.B17), Ethernet (R63.1 R64.2)
RGMII_RX_CTL: ZynqMIO (U4.D13), Ethernet (R61.2 U11.30)
RGMII_RX_D0: ZynqMIO (U4.D11), Ethernet (R60.2 U11.29)
RGMII_RX_D1: ZynqMIO (U4.A16), Ethernet (R59.2 U11.28)
RGMII_RX_D2: ZynqMIO (U4.F15), Ethernet (R57.2 U11.26)
RGMII_RX_D3: ZynqMIO (U4.A15), Ethernet (R56.2 U11.25)
RGMII_TX_CLK: ZynqMIO (R77.2), Ethernet (U11.33)
RGMII_TX_CTL: ZynqMIO (U4.F14), Ethernet (U11.32)
RGMII_TX_D0: ZynqMIO (U4.E14), Ethernet (U11.34)
RGMII_TX_D1: ZynqMIO (U4.B18), Ethernet (U11.35)
RGMII_TX_D2: ZynqMIO (U4.D10), Ethernet (U11.36)
RGMII_TX_D3: ZynqMIO (U4.A17), Ethernet (U11.37)
SPI_CLK: ZynqMIO (U4.C16), ZynqPeripherals (U6.1 U12.6)
SPI_MISO: ZynqMIO (U4.C13), ZynqPeripherals (U6.4 U12.2)
SPI_MOSI: ZynqMIO (U4.D15), ZynqPeripherals (U6.3 U12.5)
UART_RX: ZynqMIO (U4.C5), BoardConnector (J1.60)
UART_TX: ZynqMIO (R9.1), BoardConnector (J1.57)
ZYNQ_JTAG_TCK: ZynqPower (R53.2 U4.F9), BoardConnector (J1.234)
ZYNQ_JTAG_TDI: ZynqPower (R49.2 U4.G6), BoardConnector (J1.235)
ZYNQ_JTAG_TDO: ZynqPower (R27.1), BoardConnector (J1.112)
ZYNQ_JTAG_TMS: ZynqPower (R28.2 U4.J6), BoardConnector (J1.113)